# Altium project LedBtn.PrjPcb
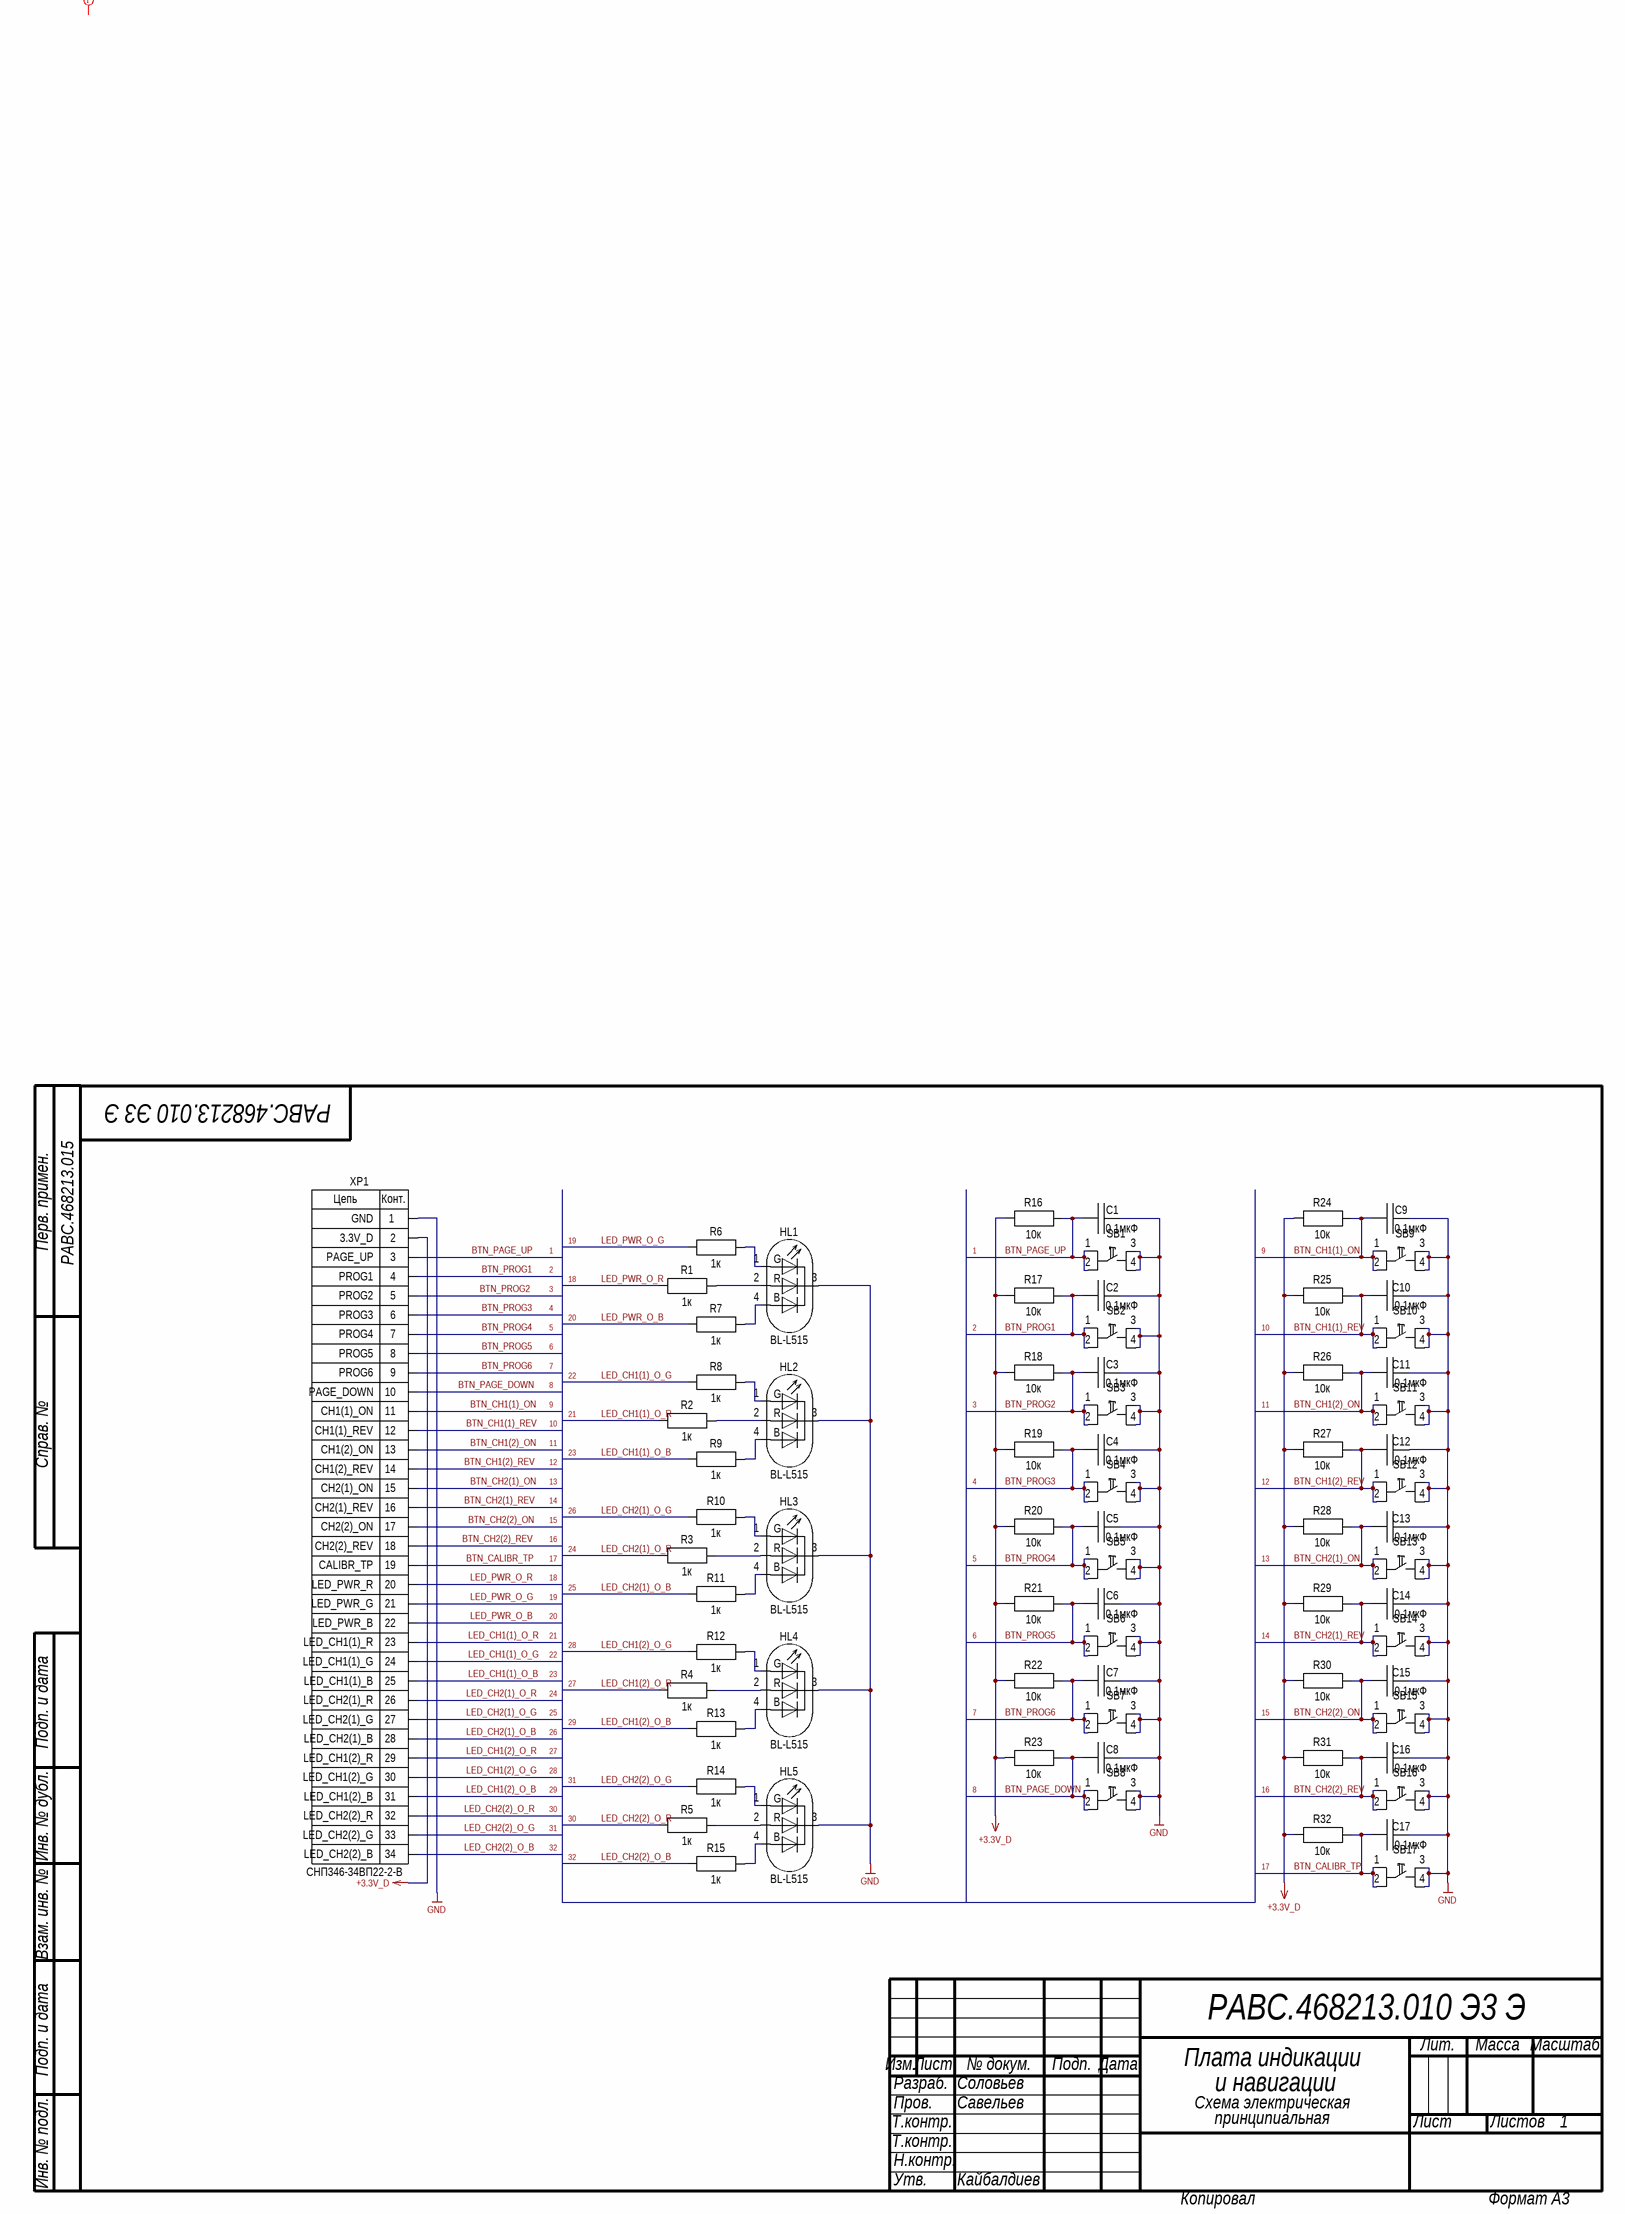
[diagram p0: LedBtn.SchDoc]
1 sheet, 72 parts. Net scope: global (net labels, ports and power ports of the same name join across sheets).
Board file: LedBtn.PcbDoc

## Sheet LedBtn.SchDoc
size 420 x 297 mm; DecimalNumber: РАВС.468213.010 Э3; MainDevice: Плата индикации и навигации; Name: Плата индикации и навигации; PageSetup: Record=PageOptions|CenterHorizontal=True|CenterVertical=True|PrintScale=0.94|XCorrection=1.00|YCorrection=1.00|PrintKind=1|BorderSize=5000000|LeftOffset=0|BottomOffset=0|Orientation=1|PaperLength=1000|PaperWidth=1000|Scale=100|PaperSource=7|PrintQuality=-4|MediaType=1|DitherType=10|PaperKind=A4|PrintScaleMode=1; ApprovedBy: Кайбалдиев; CheckedBy: Савельев; DrawnBy: Соловьев; Engineer: Т.контр.; DocumentNumber: РАВС.468213.010 Э3 Э; SheetTotal: 1; Title1str: Плата индикации; Title2str: и навигации; DocumentType1str: Схема электрическая; DocumentType2str: принципиальная; ImagePath: РАВС.468213.015

### Parts
C1  value 0,1мкФ  [Cap0805]  (hidden comment: Capacitor)
C2  value 0,1мкФ  [Cap0805]  (hidden comment: Capacitor)
C3  value 0,1мкФ  [Cap0805]  (hidden comment: Capacitor)
C4  value 0,1мкФ  [Cap0805]  (hidden comment: Capacitor)
C5  value 0,1мкФ  [Cap0805]  (hidden comment: Capacitor)
C6  value 0,1мкФ  [Cap0805]  (hidden comment: Capacitor)
C7  value 0,1мкФ  [Cap0805]  (hidden comment: Capacitor)
C8  value 0,1мкФ  [Cap0805]  (hidden comment: Capacitor)
C9  value 0,1мкФ  [Cap0805]  (hidden comment: Capacitor)
C10  value 0,1мкФ  [Cap0805]  (hidden comment: Capacitor)
C11  value 0,1мкФ  [Cap0805]  (hidden comment: Capacitor)
C12  value 0,1мкФ  [Cap0805]  (hidden comment: Capacitor)
C13  value 0,1мкФ  [Cap0805]  (hidden comment: Capacitor)
C14  value 0,1мкФ  [Cap0805]  (hidden comment: Capacitor)
C15  value 0,1мкФ  [Cap0805]  (hidden comment: Capacitor)
C16  value 0,1мкФ  [Cap0805]  (hidden comment: Capacitor)
C17  value 0,1мкФ  [Cap0805]  (hidden comment: Capacitor)
HL1  LED-RGB_C  [BL-L515]  (value not drawn)
HL2  LED-RGB_C  [BL-L515]  (value not drawn)
HL3  LED-RGB_C  [BL-L515]  (value not drawn)
HL4  LED-RGB_C  [BL-L515]  (value not drawn)
HL5  LED-RGB_C  [BL-L515]  (value not drawn)
R1  value 1к  [Res0805]  (hidden comment: Resistor0125)
R2  value 1к  [Res0805]  (hidden comment: Resistor0125)
R3  value 1к  [Res0805]  (hidden comment: Resistor0125)
R4  value 1к  [Res0805]  (hidden comment: Resistor0125)
R5  value 1к  [Res0805]  (hidden comment: Resistor0125)
R6  value 1к  [Res0805]  (hidden comment: Resistor0125)
R7  value 1к  [Res0805]  (hidden comment: Resistor0125)
R8  value 1к  [Res0805]  (hidden comment: Resistor0125)
R9  value 1к  [Res0805]  (hidden comment: Resistor0125)
R10  value 1к  [Res0805]  (hidden comment: Resistor0125)
R11  value 1к  [Res0805]  (hidden comment: Resistor0125)
R12  value 1к  [Res0805]  (hidden comment: Resistor0125)
R13  value 1к  [Res0805]  (hidden comment: Resistor0125)
R14  value 1к  [Res0805]  (hidden comment: Resistor0125)
R15  value 1к  [Res0805]  (hidden comment: Resistor0125)
R16  value 10к  [Res0603]  (hidden comment: Resistor01)
R17  value 10к  [Res0603]  (hidden comment: Resistor01)
R18  value 10к  [Res0603]  (hidden comment: Resistor01)
R19  value 10к  [Res0603]  (hidden comment: Resistor01)
R20  value 10к  [Res0603]  (hidden comment: Resistor01)
R21  value 10к  [Res0603]  (hidden comment: Resistor01)
R22  value 10к  [Res0603]  (hidden comment: Resistor01)
R23  value 10к  [Res0603]  (hidden comment: Resistor01)
R24  value 10к  [Res0603]  (hidden comment: Resistor01)
R25  value 10к  [Res0603]  (hidden comment: Resistor01)
R26  value 10к  [Res0603]  (hidden comment: Resistor01)
R27  value 10к  [Res0603]  (hidden comment: Resistor01)
R28  value 10к  [Res0603]  (hidden comment: Resistor01)
R29  value 10к  [Res0603]  (hidden comment: Resistor01)
R30  value 10к  [Res0603]  (hidden comment: Resistor01)
R31  value 10к  [Res0603]  (hidden comment: Resistor01)
R32  value 10к  [Res0603]  (hidden comment: Resistor01)
SB1  Knopka  [Switch_tact_11mm]  (value not drawn)
SB2  Knopka  [Switch_tact_11mm]  (value not drawn)
SB3  Knopka  [Switch_tact_11mm]  (value not drawn)
SB4  Knopka  [Switch_tact_11mm]  (value not drawn)
SB5  Knopka  [Switch_tact_11mm]  (value not drawn)
SB6  Knopka  [Switch_tact_11mm]  (value not drawn)
SB7  Knopka  [Switch_tact_11mm]  (value not drawn)
SB8  Knopka  [Switch_tact_11mm]  (value not drawn)
SB9  Knopka  [Switch_tact_11mm]  (value not drawn)
SB10  Knopka  [Switch_tact_11mm]  (value not drawn)
SB11  Knopka  [Switch_tact_11mm]  (value not drawn)
SB12  Knopka  [Switch_tact_11mm]  (value not drawn)
SB13  Knopka  [Switch_tact_11mm]  (value not drawn)
SB14  Knopka  [Switch_tact_11mm]  (value not drawn)
SB15  Knopka  [Switch_tact_11mm]  (value not drawn)
SB16  Knopka  [Switch_tact_11mm]  (value not drawn)
SB17  Knopka  [Switch_tact_11mm]  (value not drawn)
XP1  ConnectorP34  [PLD-34]  (value not drawn)

### Nets
+3.3V_D: R16.2 R17.2 R18.2 R19.2 R20.2 R21.2 R22.2 R23.2 R24.2 R25.2 R26.2 R27.2 R28.2 R29.2 R30.2 R31.2 R32.2 XP1.2
GND: C1.1 C2.1 C3.1 C4.1 C5.1 C6.1 C7.1 C8.1 C9.1 C10.1 C11.1 C12.1 C13.1 C14.1 C15.1 C16.1 C17.1 HL1.3(A) HL2.3(A) HL3.3(A) HL4.3(A) HL5.3(A) SB1.3 SB1.4 SB2.3 SB2.4 SB3.3 SB3.4 SB4.3 SB4.4 SB5.3 SB5.4 SB6.3 SB6.4 SB7.3 SB7.4 SB8.3 SB8.4 SB9.3 SB9.4 SB10.3 SB10.4 SB11.3 SB11.4 SB12.3 SB12.4 SB13.3 SB13.4 SB14.3 SB14.4 SB15.3 SB15.4 SB16.3 SB16.4 SB17.3 SB17.4 XP1.1
BTN_CALIBR_TP: C17.2 R32.1 SB17.1 SB17.2 XP1.19
BTN_CH1(1)_ON: C9.2 R24.1 SB9.1 SB9.2 XP1.11
BTN_CH1(1)_REV: C10.2 R25.1 SB10.1 SB10.2 XP1.12
BTN_CH1(2)_ON: C11.2 R26.1 SB11.1 SB11.2 XP1.13
BTN_CH1(2)_REV: C12.2 R27.1 SB12.1 SB12.2 XP1.14
BTN_CH2(1)_ON: C13.2 R28.1 SB13.1 SB13.2 XP1.15
BTN_CH2(1)_REV: C14.2 R29.1 SB14.1 SB14.2 XP1.16
BTN_CH2(2)_ON: C15.2 R30.1 SB15.1 SB15.2 XP1.17
BTN_CH2(2)_REV: C16.2 R31.1 SB16.1 SB16.2 XP1.18
BTN_PAGE_DOWN: C8.2 R23.1 SB8.1 SB8.2 XP1.10
BTN_PAGE_UP: C1.2 R16.1 SB1.1 SB1.2 XP1.3
BTN_PROG1: C2.2 R17.1 SB2.1 SB2.2 XP1.4
BTN_PROG2: C3.2 R18.1 SB3.1 SB3.2 XP1.5
BTN_PROG3: C4.2 R19.1 SB4.1 SB4.2 XP1.6
BTN_PROG4: C5.2 R20.1 SB5.1 SB5.2 XP1.7
BTN_PROG5: C6.2 R21.1 SB6.1 SB6.2 XP1.8
BTN_PROG6: C7.2 R22.1 SB7.1 SB7.2 XP1.9
LED_CH1(1)_O_B: R9.2 XP1.25
LED_CH1(1)_O_G: R8.2 XP1.24
LED_CH1(1)_O_R: R2.2 XP1.23
LED_CH1(2)_O_B: R13.2 XP1.31
LED_CH1(2)_O_G: R12.2 XP1.30
LED_CH1(2)_O_R: R4.2 XP1.29
LED_CH2(1)_O_B: R11.2 XP1.28
LED_CH2(1)_O_G: R10.2 XP1.27
LED_CH2(1)_O_R: R3.2 XP1.26
LED_CH2(2)_O_B: R15.2 XP1.34
LED_CH2(2)_O_G: R14.2 XP1.33
LED_CH2(2)_O_R: R5.2 XP1.32
LED_PWR_O_B: R7.2 XP1.22
LED_PWR_O_G: R6.2 XP1.21
LED_PWR_O_R: R1.2 XP1.20
NetHL1_1: HL1.1(G) R6.1
NetHL1_2: HL1.2(B) R1.1
NetHL1_4: HL1.4(R) R7.1
NetHL2_1: HL2.1(G) R8.1
NetHL2_2: HL2.2(B) R2.1
NetHL2_4: HL2.4(R) R9.1
NetHL3_1: HL3.1(G) R10.1
NetHL3_2: HL3.2(B) R3.1
NetHL3_4: HL3.4(R) R11.1
NetHL4_1: HL4.1(G) R12.1
NetHL4_2: HL4.2(B) R4.1
NetHL4_4: HL4.4(R) R13.1
NetHL5_1: HL5.1(G) R14.1
NetHL5_2: HL5.2(B) R5.1
NetHL5_4: HL5.4(R) R15.1

### Layout directives
mark named Info: (no net found under the mark)

### Notes on the sheet
- 19
- (near HL1) "POWER"
- 1
- 2
- 3
- 18
- 9
- 4
- 5
- 6
- 20
- 10
- 7
- 8
- 22
- (near HL2) "CH1(1)"
- 11
- 21
- 12
- 13
- 23
- 14
- 15
- 16
- 26
- (near HL3) "CH2(1)"
- 17
- 24
- 25
- 27
- 28
- (near HL4) "CH1(2)"
- 29
- 31
- (near HL5) "CH2(2)"
- 30
- 32
- Перв. примен.
- Справ. №
- Подп. и дата
- Инв. № дубл.
- Взам. инв. №
- Изм.
- Лист
- № докум.
- Подп.
- Дата
- Лит.
- Масса
- Масштаб
- Т.контр.
- Пров.
- Разраб.
- Листов
- Инв. № подл.
- Н.контр.
- Утв.
- Копировал
- Формат А3
- (in symbol 57) Цепь; Конт.

### Library data of the parts
C1-C17 = 2161: PartNumber: К10-84в-2012М-50 В-Н90-0,1 мкФ+80 %-20 %-N-A; Manufacturer: ОАО «ВЗРД Монолит»; ManufacturerTU: ФЦТА.673516.016ТУ; Alternative: 0805 0,1 мкФ, 50 В, ±10 %; Name: К10-84в; Group: Конденсаторы; ViewControl: В, 10%; SolderName: K10-84v-2012M-50V-N90-0,1mkF; X_SORT_1: 100; X_SORT_2: 200; X_SORT_3: 1; SolderTemperature: 175; TemperatureRange: от минус 60 до 85; CardKRR: 67; VoltageLimit: 50; Key: 2161; MilitaryControl: ВП; MountType: ПМ; Modify: 13.03.2019; Package: 0805 (2012); ComponentLink1Description: К10-84; ComponentLink1URL: \\192.168.0.101\U_Base\PDF\C\K10-84.pdf; HelpURL: \\192.168.0.101\U_Base\PDF\C\K10-84.pdf; DataSheet: #\\192.168.0.101\U_Base\PDF\C\K10-84.pdf#
HL1-HL5 = 90: Светодиод RGB с общим анодом BL-L515RGBW-CA; PartNumber: Светодиод BL-L515RGBW-CС; Notice: Betlux Electronics; Group: Светодиоды; ViewControl: В, 10%; key: 90; X_SORT_1: 500; X_SORT_2: 301; X_SORT_3: 1; Name: BL-L515; Modify: 14.03.2019; Manufacturer: Betlux Electronics; MilitaryControl: ОТК; MountType: РМ; SolderName: BL-L515; Package: 6mm; ComponentLink1Description: BL-L515; ComponentLink1URL: \\192.168.0.101\U_Base\PDF\V\BetLux Electronics.pdf; HelpURL: \\192.168.0.101\U_Base\PDF\V\BetLux Electronics.pdf; DataSheet: #\\192.168.0.101\U_Base\PDF\V\BetLux Electronics.pdf#
R1-R15 = 2957: Manufacturer: АО «НПО «Эркон»; ManufacturerTU: ОЖ0.467.164ТУ; PartNumber: Р1-8В-0,125-1 кОм±5 %-Т-А; Alternative: 0805 1 кОм, 0,125 Вт, ±5 %; Alternative2: Р1-8В-0,125-1 кОм±5 %-Т-А ОЖ0.467.164ТУ; Name: Р1-8В; Group: Резисторы; ViewControl: В, 10%; key: 2957; SolderName: R1-8B-0.125-1kOm; Mark: 102; Mass: 0,006; SolderTemperature: 255; TemperatureRange: от минус 65 до 155; CardKRR: 68; VoltageLimit: 150; PowerLimit: 0,125; X_SORT_1: 400; X_SORT_2: 100; X_SORT_3: 1; Modify: 28.06.2019; MilitaryControl: ВП; MountType: ПМ; Package: 0805 (2012); ComponentLink1Description: Р1-8В; ComponentLink1URL: \\192.168.0.101\U_Base\PDF\R\Р1-8В.pdf; HelpURL: \\192.168.0.101\U_Base\PDF\R\Р1-8В.pdf; DataSheet: #\\192.168.0.101\U_Base\PDF\R\Р1-8В.pdf#
R16-R32 = 2943: Manufacturer: АО «НПО «Эркон»; ManufacturerTU: ОЖ0.467.164ТУ; PartNumber: Р1-8В-0,1-10 кОм±5 %-Т-А; Alternative: 0603 10 кОм, 0,1 Вт, ±5 %; Alternative2: Р1-8В-0,1-10 кОм±5 %-Т-А ОЖ0.467.164ТУ; Name: Р1-8В; Group: Резисторы; ViewControl: В, 10%; key: 2943; SolderName: R1-8B-0.1-10kOm; Mark: 103; Mass: 0,002; SolderTemperature: 255; TemperatureRange: от минус 65 до 155; CardKRR: 68; VoltageLimit: 100; PowerLimit: 0,1; X_SORT_1: 400; X_SORT_3: 1; Modify: 28.06.2019; MilitaryControl: ВП; MountType: ПМ; Package: 0603 (1608); ComponentLink1Description: Р1-8В; ComponentLink1URL: \\192.168.0.101\U_Base\PDF\R\Р1-8В.pdf; HelpURL: \\192.168.0.101\U_Base\PDF\R\Р1-8В.pdf; DataSheet: #\\192.168.0.101\U_Base\PDF\R\Р1-8В.pdf#; X_SORT_2: 100
SB1-SB17 = 60: Manufacturer: KLS Electronic; PartNumber: Кнопка тактовая прямая KLS7-TS6601-11-180; Alternative: IT-1102; Name: KLS7-TS6601-11-180; Group: Кнопка тактовая; ViewControl: В,100%; Key: 60; MilitaryControl: ОТК; MountType: РМ; Modify: 05.12.2022; SolderName: KLS7-TS6601-11-180; ComponentLink1URL: \\192.168.0.101\U_Base\PDF\OTHER\KLS7-TS6601.pdf; HelpURL: \\192.168.0.101\U_Base\PDF\OTHER\KLS7-TS6601.pdf; DataSheet: #\\192.168.0.101\U_Base\PDF\OTHER\KLS7-TS6601.pdf#
XP1 = 57: Manufacturer: АО «Карачевский завод Электродеталь»; ManufacturerTU: РЮМК.430420.011ТУ; PartNumber: Вилка СНП346-34ВП22-2-В; Conn35Name: 35; Conn36Name: 36; Conn37Name: 37; Conn38Name: 38; Conn39Name: 39; Conn40Name: 40; Conn01Name: GND; Conn02Name: 3.3V_D; Conn03Name: PAGE_UP; Conn04Name: PROG1; Conn05Name: PROG2; Conn06Name: PROG3; Conn07Name: PROG4; Conn08Name: PROG5; Conn09Name: PROG6; Conn10Name: PAGE_DOWN; Conn11Name: CH1(1)_ON; Conn12Name: CH1(1)_REV; Conn13Name: CH1(2)_ON; Conn14Name: CH1(2)_REV; Conn15Name: CH2(1)_ON; Conn16Name: CH2(1)_REV; Conn17Name: CH2(2)_ON; Conn18Name: CH2(2)_REV; Conn19Name: CALIBR_TP; Conn21Name: LED_PWR_G; Conn22Name: LED_PWR_B; Conn20Name: LED_PWR_R; Conn23Name: LED_CH1(1)_R; Conn24Name: LED_CH1(1)_G; Conn25Name: LED_CH1(1)_B; Conn26Name: LED_CH2(1)_R; Conn27Name: LED_CH2(1)_G; Conn28Name: LED_CH2(1)_B; Conn29Name: LED_CH1(2)_R; Conn30Name: LED_CH1(2)_G; Conn31Name: LED_CH1(2)_B; Conn32Name: LED_CH2(2)_R; Conn33Name: LED_CH2(2)_G; Conn34Name: LED_CH2(2)_B; Alternative2: СНП346-34ВП22-2 РЮМК.430420.019ТУ; Name: СНП346-34ВП22-2-В; Value: 34; Group: Соединители; ViewControl: В, 10%; key: 57; SolderName: SNP346-34VP22-2; Mass: 0,00204; TemperatureRange: от минус 60 до 85; CardKRR: 75; VoltageLimit: 250; CurrentLimit: 1; X_SORT_1: 700; X_SORT_2: 600; Alternative: PLD-34; MilitaryControl: ВП; MountType: РМ; Modify: 19.09.2018; Package: PLD; ComponentLink1Description: СНП346; ComponentLink1URL: \\192.168.0.101\U_Base\PDF\X\СНП346.pdf; HelpURL: \\192.168.0.101\U_Base\PDF\X\СНП346.pdf; DataSheet: #\\192.168.0.101\U_Base\PDF\X\СНП346.pdf#; PowerLimit: 250; X_SORT_3: 1